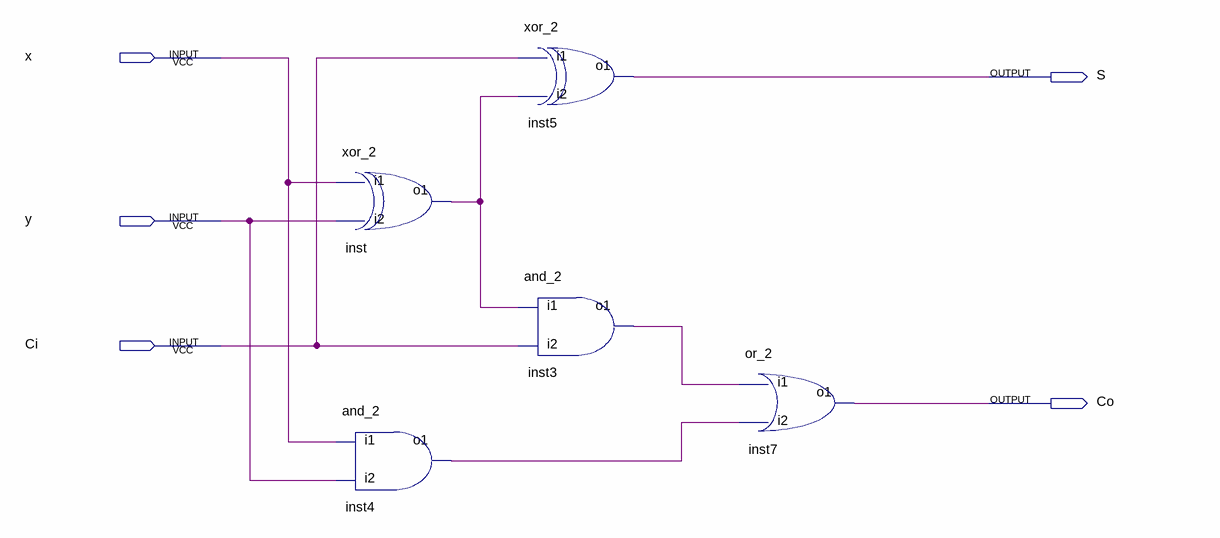
[diagram p0: schematic sheet]
// Quartus schematic FullAdder1.bdf as structural Verilog: 5 symbols, 5 pins
module FullAdder1 (
  input  x,
  input  y,
  input  Ci,
  output S,
  output Co
);

  wire inst3_o1, inst4_o1, inst_o1;

  xor_2 inst (.i1(x), .i2(y), .o1(inst_o1));
  and_2 inst4 (.i1(x), .i2(y), .o1(inst4_o1));
  xor_2 inst5 (.i1(Ci), .i2(inst_o1), .o1(S));
  and_2 inst3 (.i1(inst_o1), .i2(Ci), .o1(inst3_o1));
  or_2 inst7 (.i1(inst3_o1), .i2(inst4_o1), .o1(Co));
endmodule
